# EAGLE design blimp_v2 (EAGLE 9.6.2)
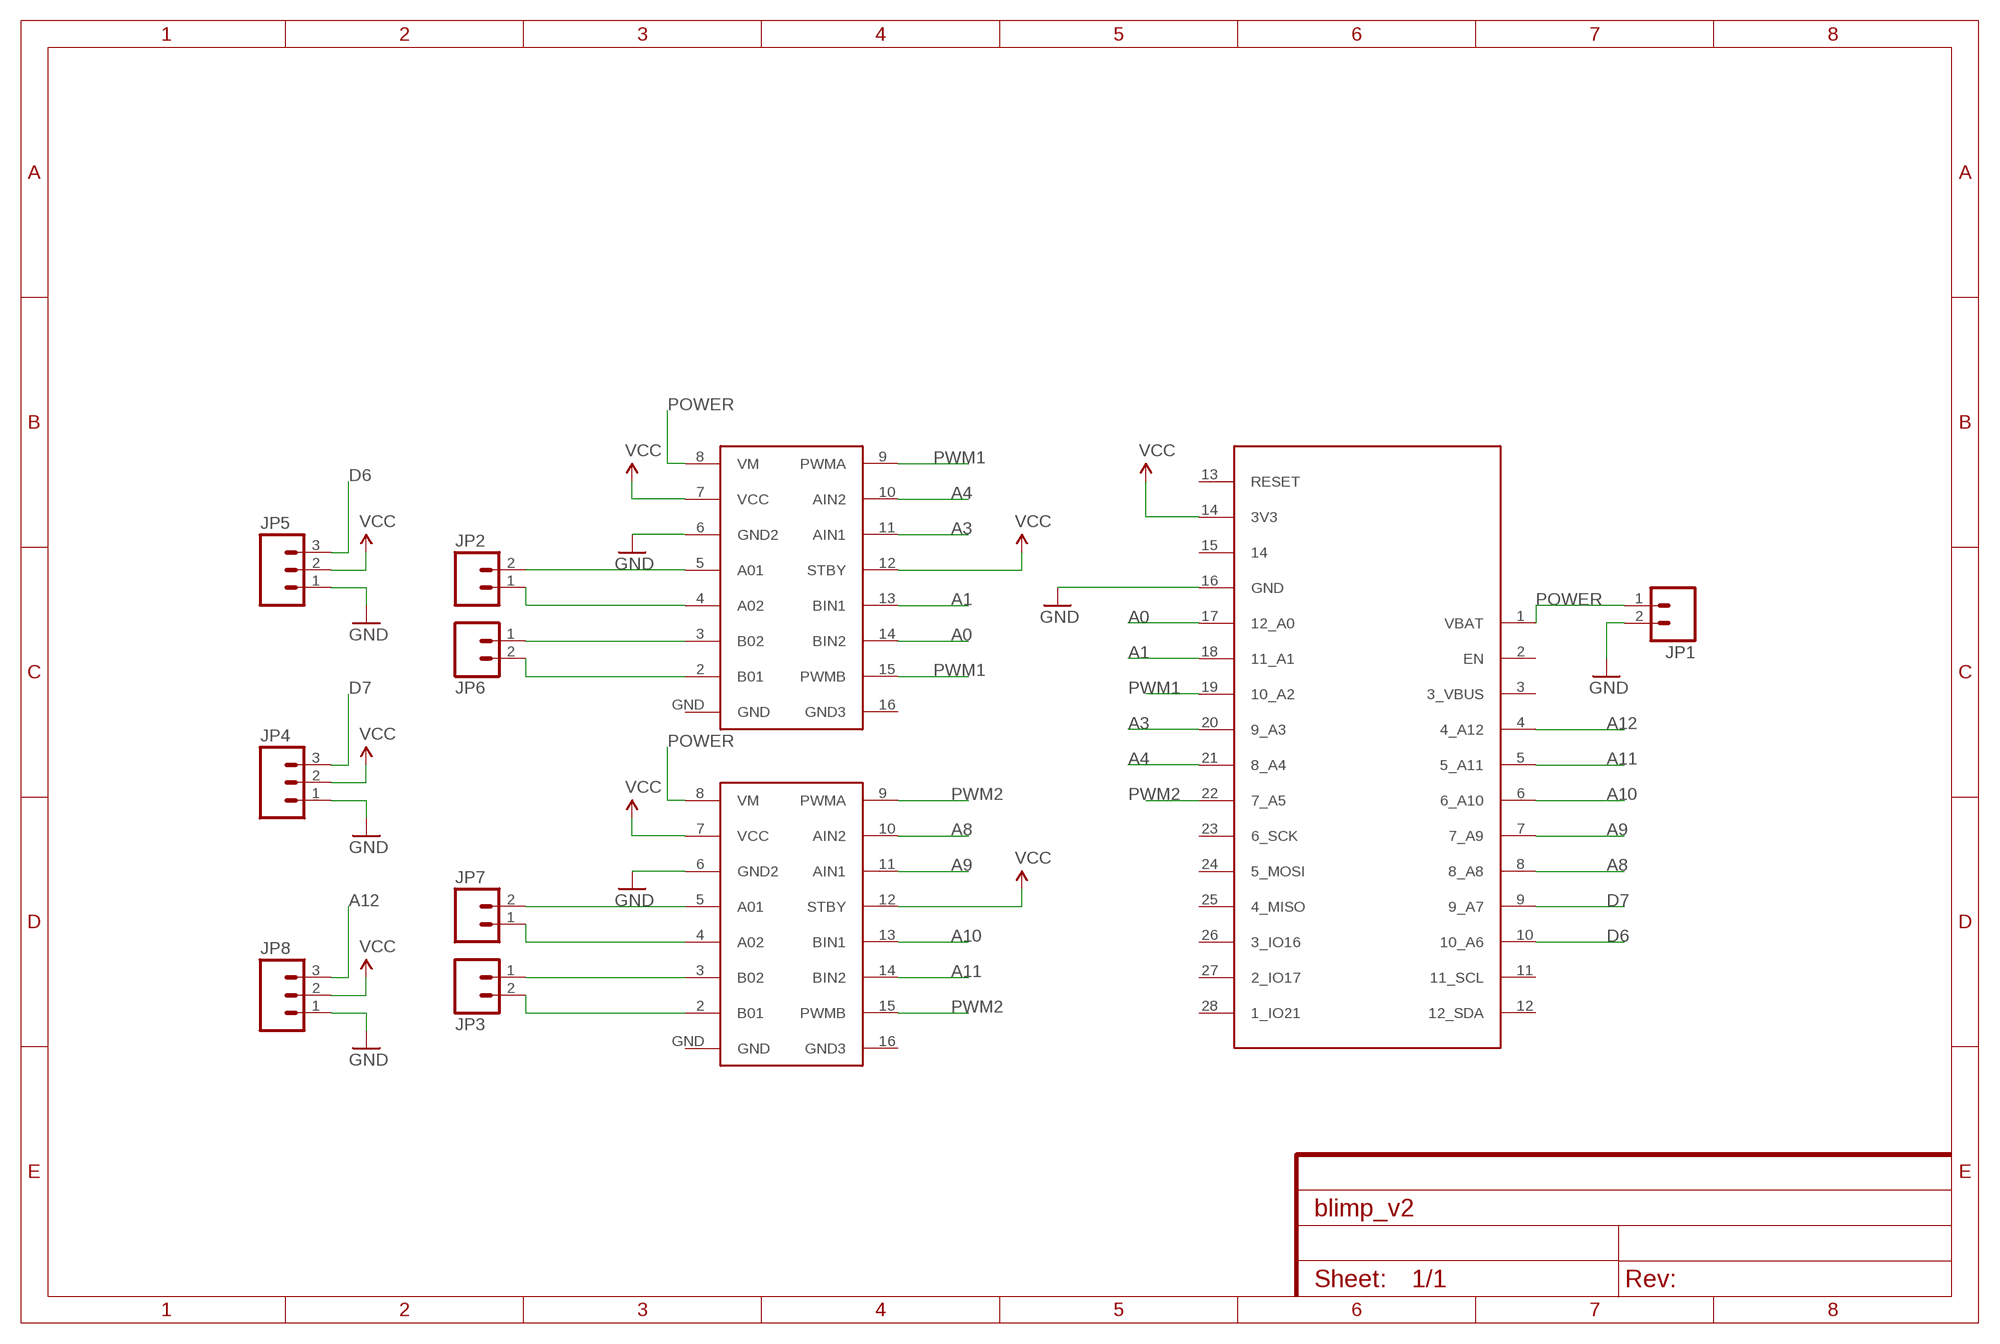
[diagram p0: schematic, sheet 1]

## Parts
JP1  M02-JST-2MM-SMT  [JST-2-SMD]
JP2  M02PTH  [1X02]
JP3  M02PTH  [1X02]
JP4  M03PTH  [1X03]
JP5  M03PTH  [1X03]
JP6  M02PTH  [1X02]
JP7  M02PTH  [1X02]
JP8  M03PTH  [1X03]
U$1  ESP32  [ESP32]
U$2  TB6612  [TB6612]
U$4  TB6612  [TB6612]

## Nets
A0: U$1.17(12_A0) U$4.14(BIN2)
A1: U$1.18(11_A1) U$4.13(BIN1)
A3: U$1.20(9_A3) U$4.11(AIN1)
A4: U$1.21(8_A4) U$4.10(AIN2)
A8: U$1.8(8_A8) U$2.10(AIN2)
A9: U$1.7(7_A9) U$2.11(AIN1)
A10: U$1.6(6_A10) U$2.13(BIN1)
A11: U$1.5(5_A11) U$2.14(BIN2)
A12: JP8.3 U$1.4(4_A12)
D6: JP5.3 U$1.10(10_A6)
D7: JP4.3 U$1.9(9_A7)
GND: JP1.2 JP4.1 JP5.1 JP8.1 U$1.16(GND) U$2.6(GND2) U$4.6(GND2)
N$1: JP2.2 U$4.5(A01)
N$2: JP2.1 U$4.4(A02)
N$3: JP7.2 U$2.5(A01)
N$4: JP7.1 U$2.4(A02)
N$7: JP6.1 U$4.3(B02)
N$8: JP6.2 U$4.2(B01)
N$9: JP3.1 U$2.3(B02)
N$13: JP3.2 U$2.2(B01)
POWER: JP1.1 U$1.1(VBAT) U$2.8(VM) U$4.8(VM)
PWM1: U$1.19(10_A2) U$4.9(PWMA) U$4.15(PWMB)
PWM2: U$1.22(7_A5) U$2.9(PWMA) U$2.15(PWMB)
VCC: JP4.2 JP5.2 JP8.2 U$1.14(3V3) U$2.7(VCC) U$2.12(STBY) U$4.7(VCC) U$4.12(STBY)
Unconnected: U$1.2(EN) U$1.3(3_VBUS) U$1.11(11_SCL) U$1.12(12_SDA) U$1.13(RESET) U$1.15 U$1.23(6_SCK) U$1.24(5_MOSI) U$1.25(4_MISO) U$1.26(3_IO16) U$1.27(2_IO17) U$1.28(1_IO21) U$2.16(GND3) U$2.GND U$4.16(GND3) U$4.GND

## Library data of the parts
JP1-JP3 JP6 JP7 = SparkFun:M02: Header 2 Standard 2-pin 0.1" header. Use with straight break away headers (SKU : PRT-00116), right angle break away headers (PRT-00553), swiss pins (PRT-00743), machine pins (PRT-00117), and female headers (PRT-00115). Molex polarized connector foot print use with SKU : PRT-08233 with associated crimp pins and housings.
JP4 JP5 JP8 = SparkFun:M03: Header 3 Standard 3-pin 0.1" header. Use with straight break away headers (SKU : PRT-00116), right angle break away headers (PRT-00553), swiss pins (PRT-00743), machine pins (PRT-00117), and female headers (PRT-00115). Molex polarized connector foot print use with SKU : PRT-08232 with associated crimp pins and housings.
U$1 = blimp:ESP32
U$2 U$4 = blimp:TB6612

## Board
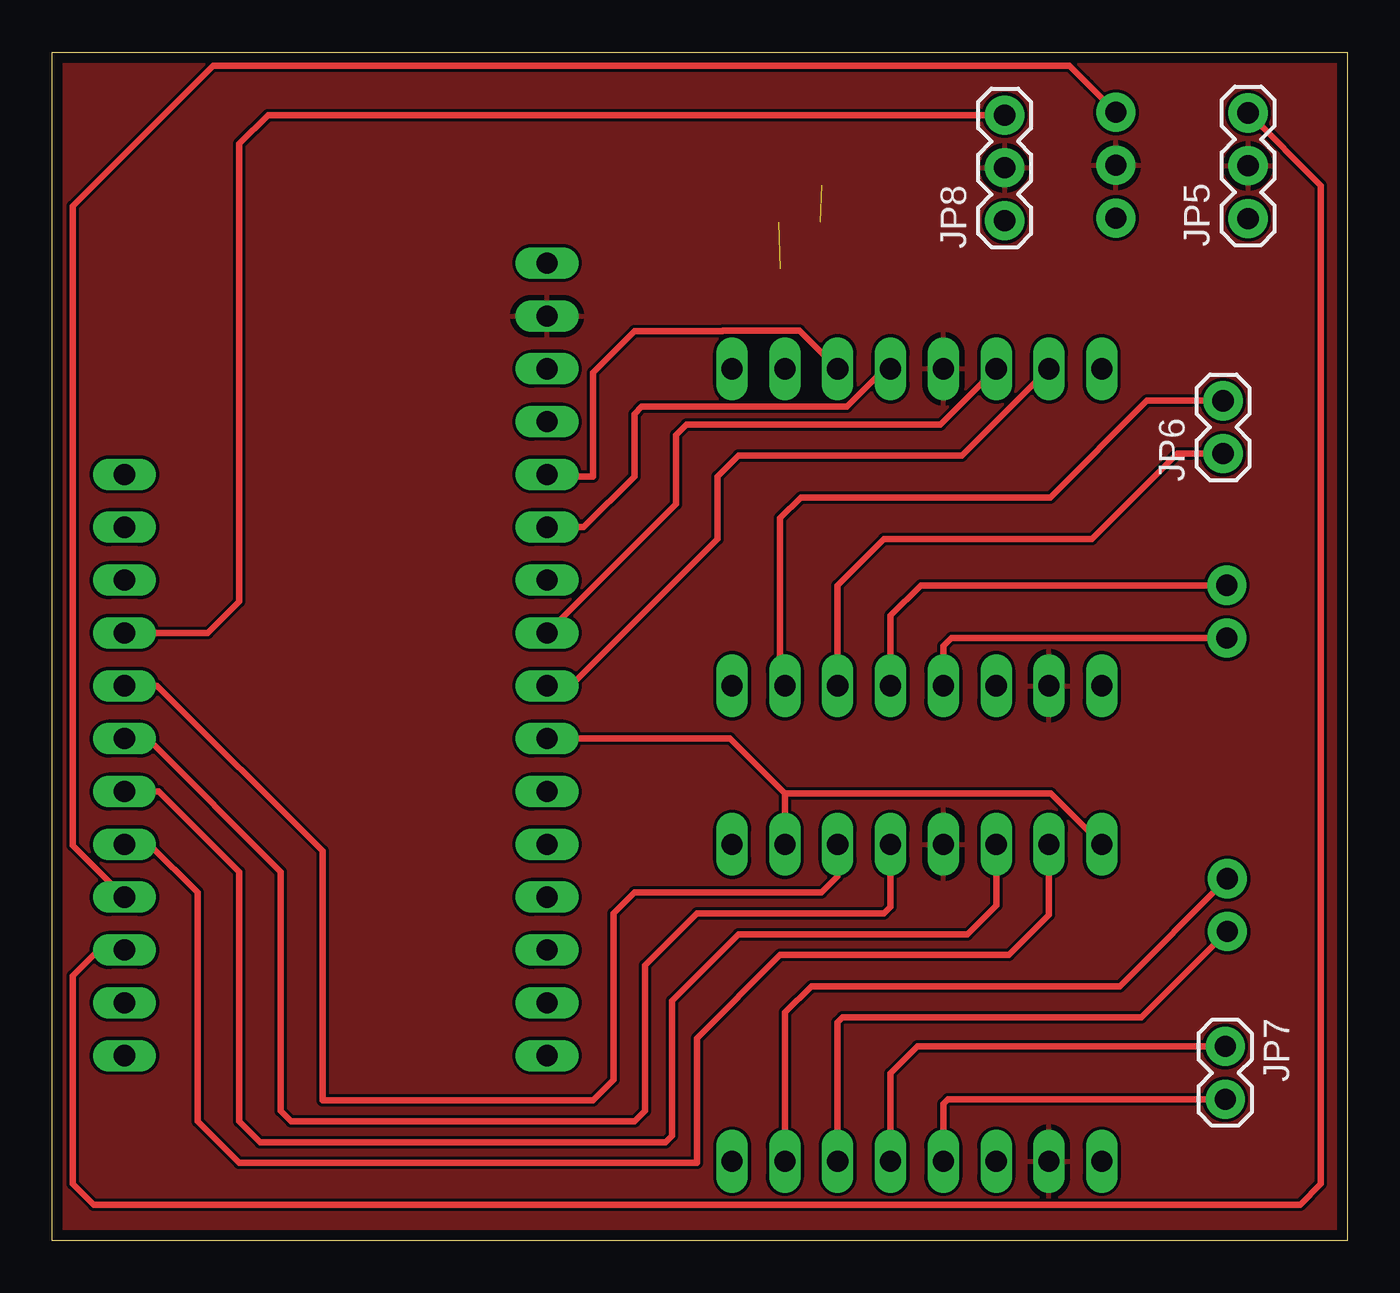
[diagram p1: board, top side]
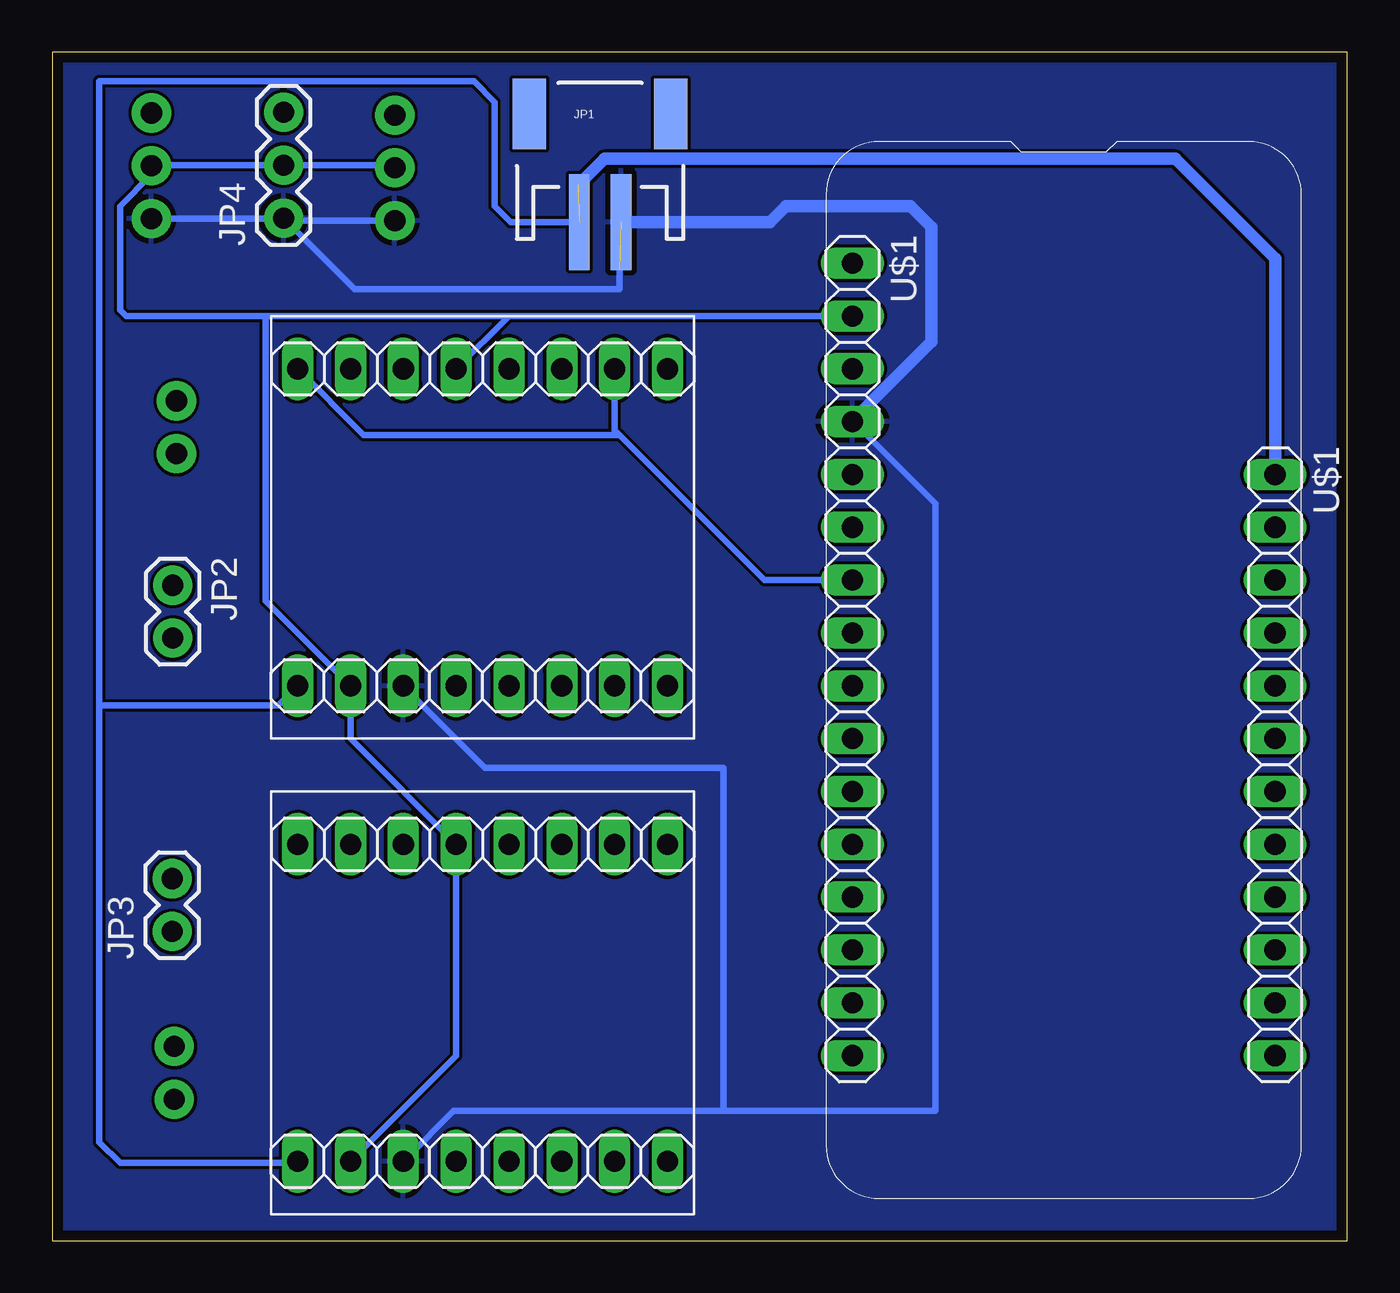
[diagram p2: board, bottom side, seen from below]

Size 62.28 x 57.14 mm. Coordinates in mm from the lower left corner, seen from the top.
Outline: 62.28,0 0,0 0,57.14 62.28,57.14 62.28,0
Copper layers (1*16): Top 0.035mm / dielectric 1.5mm / Bottom 0.035mm
Design rules "default *": minimum track width 12mil, minimum drill 0.35mm, track to track 6mil, track to pad 6mil, pad to pad 6mil, via to via 6mil, smd to smd 6mil, copper to edge 20mil, drill to drill 6mil, minimum pad ring 10mil, minimum via ring 8mil, stop-mask expansion 4mil, vias tented up to drill 0mil, thermal gap 10mil

### Footprints (pad centres in the part's own frame; a part is rotated, then mirrored left to right if it is on the bottom)
JST-2-SMD = smd 1 x 4.6: 1 -1,-3.7; 2 1,-3.7 | smd 1.6 x 3.4: NC1 -3.4,1.5; NC2 3.4,1.5
1X02 = drill 1.016 pad 1.88: 1 0,0; 2 2.54,0
1X03 = drill 1.016 pad 1.88: 1 0,0; 2 2.54,0; 3 5.08,0
ESP32 = drill 1.016 long: 1 -13.97,10.16; 2 -11.43,10.16; 3 -8.89,10.16; 4 -6.35,10.16; 5 -3.81,10.16; 6 -1.27,10.16; 7 1.27,10.16; 8 3.81,10.16; 9 6.35,10.16; 10 8.89,10.16; 11 11.43,10.16; 12 13.97,10.16; 13 -24.13,-10.16; 14 -21.59,-10.16; 15 -19.05,-10.16; 16 -16.51,-10.16; 17 -13.97,-10.16; 18 -11.43,-10.16; 19 -8.89,-10.16; 20 -6.35,-10.16; 21 -3.81,-10.16; 22 -1.27,-10.16; 23 1.27,-10.16; 24 3.81,-10.16; 25 6.35,-10.16; 26 8.89,-10.16; 27 11.43,-10.16; 28 13.97,-10.16
TB6612 = drill 1.016 long: 2 -7.62,-6.35; 3 -7.62,-3.81; 4 -7.62,-1.27; 5 -7.62,1.27; 6 -7.62,3.81; 7 -7.62,6.35; 8 -7.62,8.89; 9 7.62,8.89; 10 7.62,6.35; 11 7.62,3.81; 12 7.62,1.27; 13 7.62,-1.27; 14 7.62,-3.81; 15 7.62,-6.35; 16 7.62,-8.89; GND -7.62,-8.89

### Placement (x,y rotation side)
JP1  35.93,52.66 0 bottom
JP2  56.47,31.5 270 bottom
JP3  56.51,14.86 90 bottom
JP4  51.15,49.16 90 bottom
JP5  57.5,49.13 90 top
JP6  56.3,37.83 90 top
JP7  56.4,9.33 270 top
JP8  45.8,49.03 90 top
U$1  13.64,22.86 270 bottom
U$2  41.58,11.43 90 bottom
U$4  41.58,34.29 90 bottom

### Tracks (layer width: path | path; a pad name or v marks a point on that pad's centre or on a via)
A0
  Top 0.305: U$4.14 35.94,43.74 32.25,43.74 32.24,43.73 28,43.73 26,41.73 26,36.73 23.9,36.73 U$1.17
A1
  Top 0.305: U$1.18 25.56,34.29 28,36.73 28,39.73 28.35,40.08 38.21,40.08 40.04,41.91 U$4.13
A3
  Top 0.305: U$4.11 42.71,39.23 30.5,39.23 30,38.73 30,35.41 U$1.20
A4
  Top 0.305: U$4.10 43.75,37.73 33,37.73 32,36.73 32,33.73 24.94,26.67 U$1.21
A8
  Top 0.305: U$2.10 47.93,15.66 46,13.73 35,13.73 31,9.73 31,3.73 9,3.73 7,5.73 7,16.73 4.68,19.05 U$1.8
A9
  Top 0.305: U$2.11 45.39,16.12 44,14.73 33,14.73 29.8,11.53 29.8,5.03 29.5,4.73 10,4.73 9,5.73 9,17.73 5.14,21.59 U$1.7
A10
  Top 0.305: U$2.13 40.31,16.04 40,15.73 31,15.73 28.5,13.23 28.5,6.23 28,5.73 11.5,5.73 11,6.23 11,17.73 4.6,24.13 U$1.6
A11
  Top 0.305: U$1.5 5.06,26.67 13,18.73 13,6.73 26,6.73 27,7.73 27,15.73 28,16.73 37,16.73 37.77,17.5 U$2.14
A12
  Top 0.305: JP8.3 10.38,54.11 9,52.73 9,30.73 7.48,29.21 U$1.4
D6
  Top 0.305: JP5.3 61,50.71 61,2.73 60,1.73 2,1.73 1,2.73 1,12.73 2.24,13.97 U$1.10
D7
  Top 0.305: U$1.9 1,18.99 1,49.73 7.75,56.48 48.91,56.48 49.66,55.73 49.83,55.56 JP4.3
GND  (1 unrouted)
  Bottom 0.305: 35,46.73 35,45.73 47.72,45.73 JP4.1 51.18,49.13 | JP5.1 51.18,49.13 | U$2.6 45.23,3.97 | 45.23,3.97 42.97,6.23 30,6.23 | 30,6.23 19.8,6.23 19.8,35.42 23.8,39.42 | 45.5,3.97 45.23,3.97 | U$4.6 41.45,22.73 30,22.73 30,6.23 | JP8.1 51.08,49.03 51.18,49.13
  Bottom 0.61: U$1.16 23.8,39.42 20,43.22 20,48.73 21,49.73 27,49.73 27.77,48.96 JP1.2
  pour Bottom: 64.55,59.42 -1.6,59.42 -1.6,-2.54 64.55,-2.54
N$1
  Top 0.305: JP2.2 43.23,28.96 42.85,28.58 U$4.5
N$2
  Top 0.305: JP2.1 41.77,31.5 40.31,30.04 U$4.4
N$3
  Top 0.305: JP7.2 43.06,6.79 42.85,6.58 U$2.5
N$4
  Top 0.305: JP7.1 41.6,9.33 40.31,8.04 U$2.4
N$7
  Top 0.305: JP6.1 54.1,37.83 50,33.73 40,33.73 37.77,31.5 U$4.3
N$8
  Top 0.305: JP6.2 52.64,40.37 48,35.73 36,35.73 35,34.73 35,26.9 U$4.2
N$9
  Top 0.305: U$2.3 37.77,10.5 38,10.73 52.38,10.73 JP3.1
N$13
  Top 0.305: JP3.2 51.34,12.23 36.5,12.23 35.23,10.96 U$2.2
POWER  (1 unrouted)
  Bottom 0.305: JP1.1 37,48.96 39.23,48.96 40.23,48.96 41,49.73 41,54.73 42,55.73 60,55.73 60,25.73 | 60,25.73 51.41,25.73 U$4.8 | 60,25.73 60,4.73 59,3.73 50.55,3.73 U$2.8
  Bottom 0.61: U$1.1 3.48,47.21 8.27,52 35.73,52 37,50.73
PWM1
  Bottom 0.305: U$1.19 28.02,31.75 35,38.73 | 35,38.73 35.23,38.96 U$4.15 | 35,38.73 47.29,38.73 U$4.9
PWM2
  Top 0.305: U$1.22 32.6,24.13 35.23,21.5 | U$2.15 35.23,21.5 | 35.23,21.5 48.02,21.5 U$2.9
VCC
  Bottom 0.305: 24,44.45 U$1.14 40.31,44.45 | 42.85,18.88 U$2.12 | 48,3.88 U$2.7 42.85,8.89 U$2.12 | 40.31,44.45 U$4.12 | 52,44.45 58.72,44.45 59,44.73 59,49.73 57.5,51.23 JP5.2 57.47,51.7 JP4.2 45.93,51.7 JP8.2 | 52,44.45 40.31,44.45 | 52,44.45 52,30.74 U$4.7 47.93,24.13 U$2.12
  pour Top: 65.82,61.96 -2.87,61.96 -2.87,-5.08 65.82,-5.08